# Altium schematic sheet Signal_TX_Group.SchDoc
size 215 x 152 mm; SheetNumber: 2; SheetTotal: 4
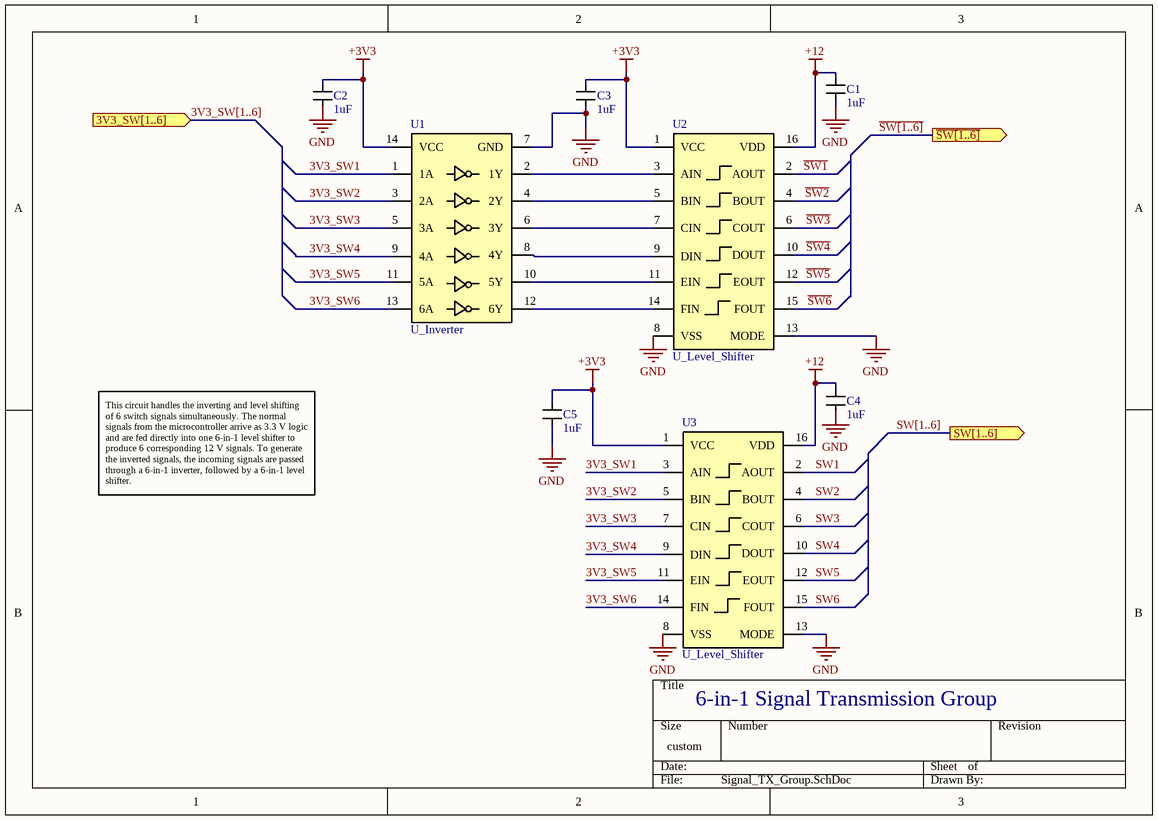
[diagram p0: Signal_TX_Group.SchDoc]

## Parts
C1  1uF  [0603_CAP]
C2  1uF  [0603_CAP]
C3  1uF  [0603_CAP]
C4  1uF  [0603_CAP]
C5  1uF  [0603_CAP]
U1  U_Inverter  [INVERTER]
U2  U_Level_Shifter  [LEVEL_SHIFTER]
U3  U_Level_Shifter  [LEVEL_SHIFTER]

## Ports
3V3_SW[1..6] (in, see Load_Bank_Master[3C]), SW[1..6] (out, see Load_Bank_Master[3C]), ~{SW[1..6]} (out, see Load_Bank_Master[3C])

## Nets
+3V3: C2.2 C3.2 C5.2 U1.14(VCC) U2.1(VCC) U3.1(VCC)
+12: C1.2 C4.2 U2.16(VDD) U3.16(VDD)
GND: C1.1 C2.1 C3.1 C4.1 C5.1 U1.7(GND) U2.8(VSS) U2.13(MODE) U3.8(VSS) U3.13(MODE)
3V3_SW1: U1.1(1A) U3.3(AIN)
3V3_SW2: U1.3(2A) U3.5(BIN)
3V3_SW3: U1.5(3A) U3.7(CIN)
3V3_SW4: U1.9(4A) U3.9(DIN)
3V3_SW5: U1.11(5A) U3.11(EIN)
3V3_SW6: U1.13(6A) U3.14(FIN)
~{SW1}: U2.2(AOUT)
~{SW2}: U2.4(BOUT)
~{SW3}: U2.6(COUT)
~{SW4}: U2.10(DOUT)
~{SW5}: U2.12(EOUT)
~{SW6}: U2.15(FOUT)
SW1: U3.2(AOUT)
SW2: U3.4(BOUT)
SW3: U3.6(COUT)
SW4: U3.10(DOUT)
SW5: U3.12(EOUT)
SW6: U3.15(FOUT)
NetU1_2: U1.2(1Y) U2.3(AIN)
NetU1_4: U1.4(2Y) U2.5(BIN)
NetU1_6: U1.6(3Y) U2.7(CIN)
NetU1_8: U1.8(4Y) U2.9(DIN)
NetU1_10: U1.10(5Y) U2.11(EIN)
NetU1_12: U1.12(6Y) U2.14(FIN)

## Buses and harness runs
bus 3V3_SW[1..6] = port 3V3_SW[1..6]
bus SW[1..6] = port SW[1..6]
bus ~{SW[1..6]} = port ~{SW[1..6]}

## Notes on the sheet
- This circuit handles the inverting and level shifting of 6 switch signals simultaneously. The normal signals from the microcontroller arrive as 3.3 V logic and are fed directly into one 6-in-1 level shifter to produce 6 corresponding 12 V signals. To generate the inverted signals, the incoming signals are passed through a 6-in-1 inverter, followed by a 6-in-1 level shifter.
- 6-in-1 Signal Transmission Group

## Library data of the parts
C1-C5 = C_1uF_0603: Capacitor SMD MLCC 1 uF 0603 25 V
U1 = U_Inverter: IC 6-in-1 inverter
U2 U3 = U_Level_Shifter: IC 6-in-1 level shifter